# EAGLE design CommPosition_V1.0_Mar2016 (EAGLE 7.5.0)
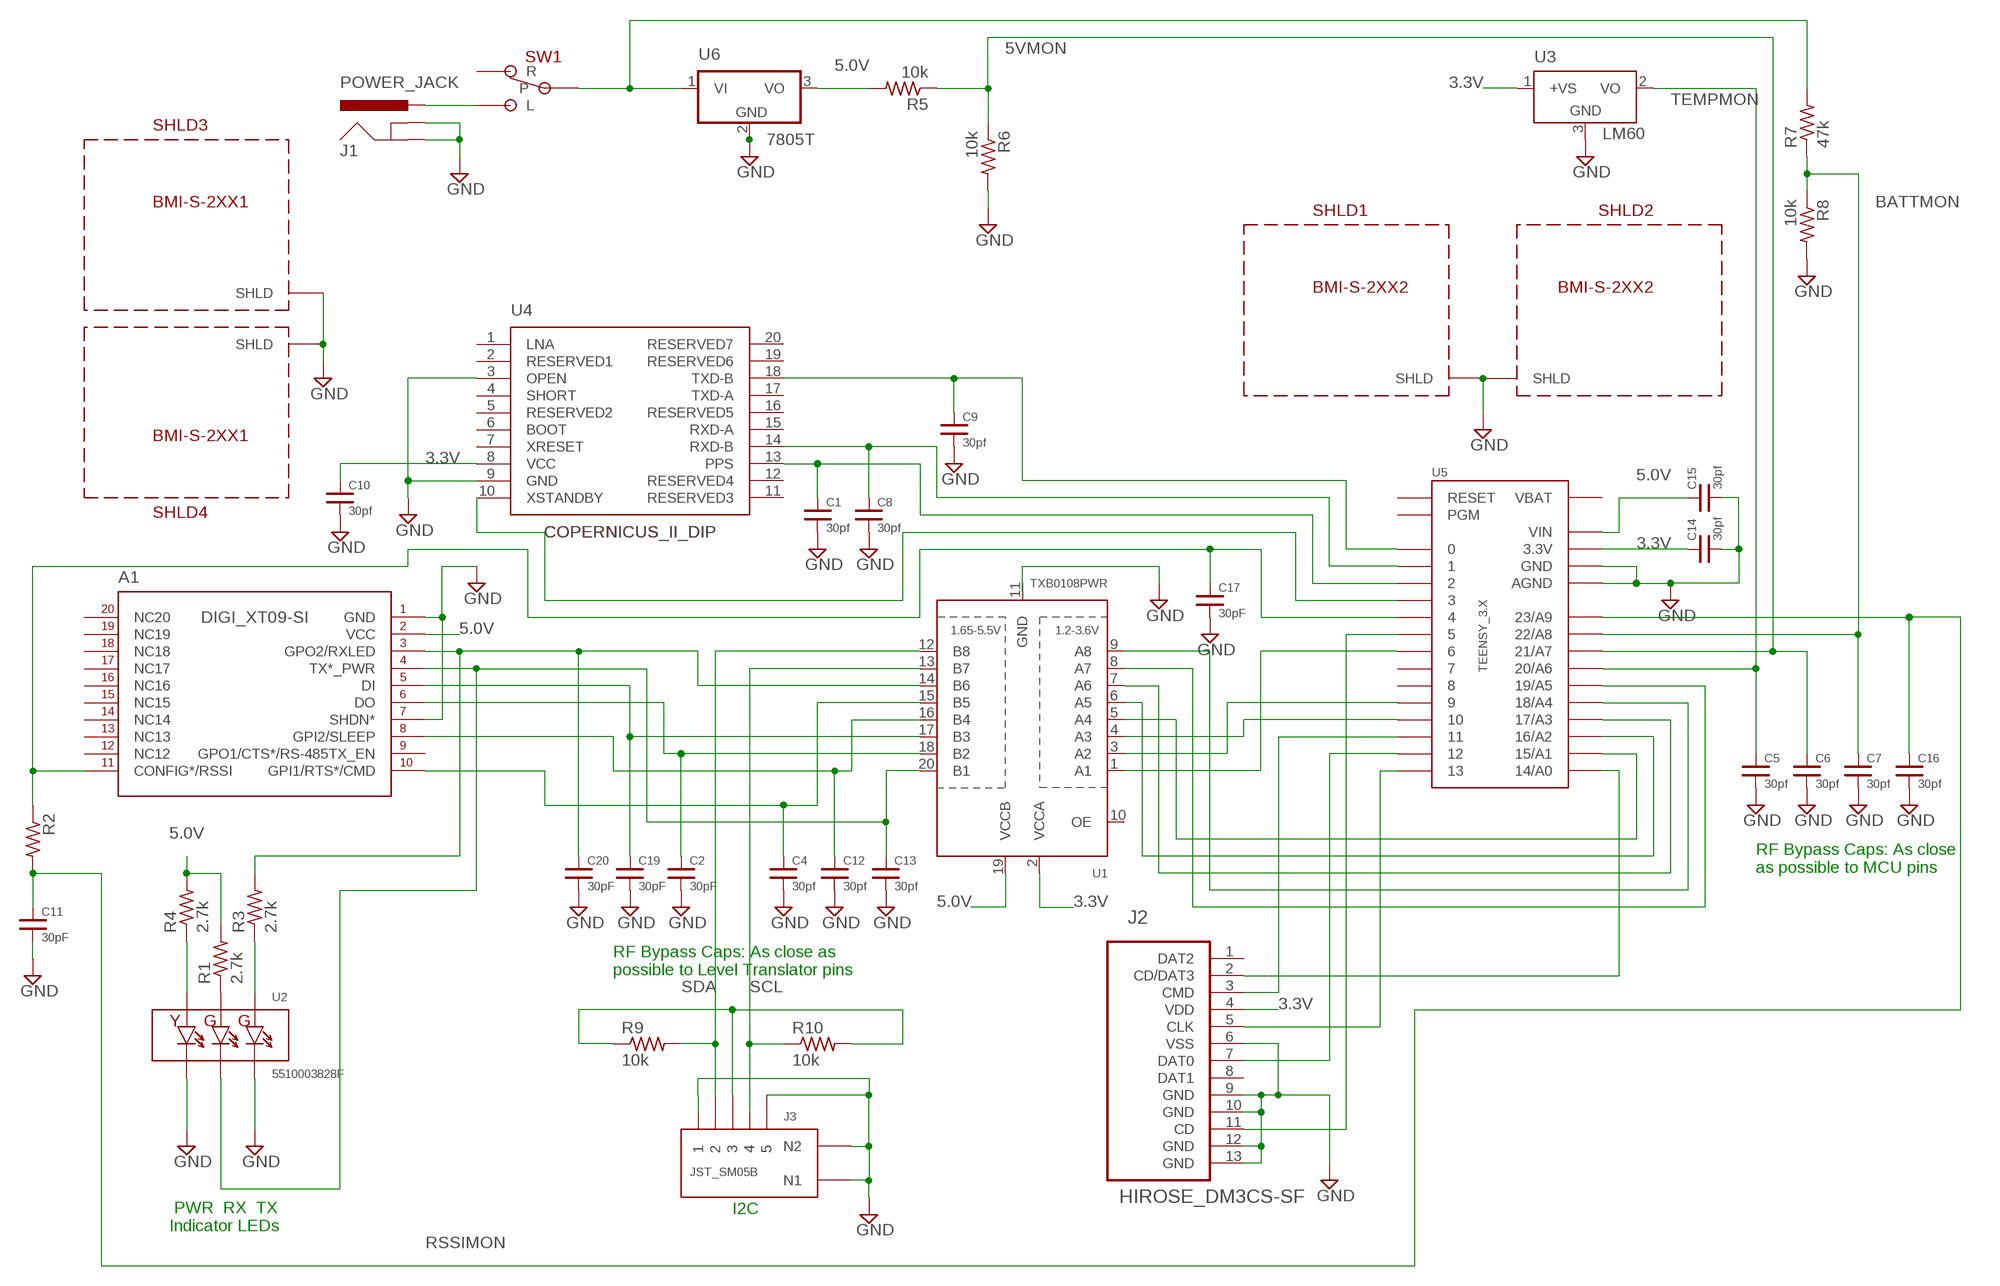
[diagram p0: schematic, sheet 1]

## Parts
A1  DIGI_XT09-SI  [DIGI_XT09-SI]
C1  30pf  C-USC0603  [C0603]
C2  30pF  C-USC0603  [C0603]
C4  30pf  C-USC0603  [C0603]
C5  30pf  C-USC0603  [C0603]
C6  30pf  C-USC0603  [C0603]
C7  30pf  C-USC0603  [C0603]
C8  30pf  C-USC0603  [C0603]
C9  30pf  C-USC0603  [C0603]
C10  30pf  C-USC0603  [C0603]
C11  30pF  C-USC0603  [C0603]
C12  30pf  C-USC0603  [C0603]
C13  30pf  C-USC0603  [C0603]
C14  30pf  C-USC0603  [C0603]
C15  30pf  C-USC0603  [C0603]
C16  30pf  C-USC0603  [C0603]
C17  30pF  C-USC0603  [C0603]
C19  30pF  C-USC0603  [C0603]
C20  30pF  C-USC0603  [C0603]
J1  POWER_JACK  [PWR_JACK_BB]
J2  HIROSE_DM3CS-SF  [HIROSE_DM3CS-SF]
J3  JST_SM05B  [JST_SM05B]
R1  2.7k  R-US_R0805  [R0805]
R2  R-US_R0805  [R0805]
R3  2.7k  R-US_R0805  [R0805]
R4  2.7k  R-US_R0805  [R0805]
R5  10k  R-US_R0805  [R0805]
R6  10k  R-US_R0805  [R0805]
R7  47k  R-US_R0805  [R0805]
R8  10k  R-US_R0805  [R0805]
R9  10k  R-US_R0805  [R0805]
R10  10k  R-US_R0805  [R0805]
SHLD1  BMI-S-2XX2  [BMI-S-207-F]
SHLD2  BMI-S-2XX2  [BMI-S-207-F]
SHLD3  BMI-S-2XX1  [BMI-S-206-F]
SHLD4  BMI-S-2XX1  [BMI-S-206-F]
SW1  SPDT_RA_3A  [ESWITCH_SPDT_RA]
U1  TXB0108PWR  [TSSOP20]
U2  5510003828F  [TRIPLE_LED_SIDE_0.1IN]
U3  LM60  [TO92]
U4  COPERNICUS_II_DIP  [COPERNICUS_II_DIP]
U5  TEENSY_3.X  [TEENSY_3.X_PERIPHERY]
U6  7805T  [TO220H]

## Nets
3.3V: C10.1 C14.1 J2.4(VDD) U1.2(VCCA) U3.1(+VS) U4.8(VCC) U5.3.3V U5.3.3V1(3.3V)
5.0V: A1.P$2(VCC) C15.1 R1.2 R4.2 R5.2 U1.19(VCCB) U5.VIN U6.3(VO)
5VMON: C6.1 R5.1 R6.1 U5.21/A7
BATTMON: C7.1 R7.1 R8.1 U5.22/A8
GND: A1.P$1(GND) A1.P$7(SHDN*) A1.P$21(GND) A1.P$22(GND) A1.P$23(GND) A1.P$24(GND) C1.2 C2.2 C4.2 C5.2 C6.2 C7.2 C8.2 C9.2 C10.2 C11.2 C12.2 C13.2 C14.2 C15.2 C16.2 C17.2 C19.2 C20.2 J1.GND J1.GNDBREAK J2.6(VSS) J2.9(GND) J2.10(GND) J2.12(GND) J2.13(GND) J3.P$1 J3.P$5 J3.P$6(N1) J3.P$7(N2) R6.2 R8.2 SHLD1.P$2(SHLD) SHLD1.P$3(SHLD) SHLD1.P$4(SHLD) SHLD1.P$5(SHLD) SHLD1.P$6(SHLD) SHLD1.P$7(SHLD) SHLD1.P$8(SHLD) SHLD1.P$9(SHLD) SHLD1.P$10(SHLD) SHLD1.P$11(SHLD) SHLD1.P$12(SHLD) SHLD1.P$14(SHLD) SHLD1.P$15(SHLD) SHLD1.P$16(SHLD) SHLD1.P$17(SHLD) SHLD1.P$18(SHLD) SHLD1.P$19(SHLD) SHLD1.P$20(SHLD) SHLD1.P$21(SHLD) SHLD1.P$22(SHLD) SHLD1.P$23(SHLD) SHLD1.P$24(SHLD) SHLD1.P$25(SHLD) SHLD1.P$26(SHLD) SHLD1.P$27(SHLD) SHLD1.P$28(SHLD) SHLD1.P$29(SHLD) SHLD1.P$30(SHLD) SHLD1.P$31(SHLD) SHLD1.P$32(SHLD) SHLD1.P$33(SHLD) SHLD1.P$34(SHLD) SHLD2.P$2(SHLD) SHLD2.P$3(SHLD) SHLD2.P$4(SHLD) SHLD2.P$5(SHLD) SHLD2.P$6(SHLD) SHLD2.P$7(SHLD) SHLD2.P$8(SHLD) SHLD2.P$9(SHLD) SHLD2.P$10(SHLD) SHLD2.P$11(SHLD) SHLD2.P$12(SHLD) SHLD2.P$14(SHLD) SHLD2.P$15(SHLD) SHLD2.P$16(SHLD) SHLD2.P$17(SHLD) SHLD2.P$18(SHLD) SHLD2.P$19(SHLD) SHLD2.P$20(SHLD) SHLD2.P$21(SHLD) SHLD2.P$22(SHLD) SHLD2.P$23(SHLD) SHLD2.P$24(SHLD) SHLD2.P$25(SHLD) SHLD2.P$26(SHLD) SHLD2.P$27(SHLD) SHLD2.P$28(SHLD) SHLD2.P$29(SHLD) SHLD2.P$30(SHLD) SHLD2.P$31(SHLD) SHLD2.P$32(SHLD) SHLD2.P$33(SHLD) SHLD2.P$34(SHLD) SHLD3.P$1(SHLD) SHLD3.P$2(SHLD) SHLD3.P$3(SHLD) SHLD3.P$4(SHLD) SHLD3.P$5(SHLD) SHLD3.P$6(SHLD) SHLD3.P$7(SHLD) SHLD3.P$8(SHLD) SHLD3.P$9(SHLD) SHLD3.P$10(SHLD) SHLD3.P$11(SHLD) SHLD3.P$12(SHLD) SHLD3.P$14(SHLD) SHLD3.P$15(SHLD) SHLD3.P$16(SHLD) SHLD3.P$17(SHLD) SHLD3.P$18(SHLD) SHLD3.P$21(SHLD) SHLD3.P$22(SHLD) SHLD3.P$23(SHLD) SHLD3.P$24(SHLD) SHLD3.P$25(SHLD) SHLD3.P$31(SHLD) SHLD3.P$32(SHLD) SHLD4.P$1(SHLD) SHLD4.P$2(SHLD) SHLD4.P$3(SHLD) SHLD4.P$4(SHLD) SHLD4.P$5(SHLD) SHLD4.P$6(SHLD) SHLD4.P$7(SHLD) SHLD4.P$8(SHLD) SHLD4.P$9(SHLD) SHLD4.P$10(SHLD) SHLD4.P$11(SHLD) SHLD4.P$12(SHLD) SHLD4.P$14(SHLD) SHLD4.P$15(SHLD) SHLD4.P$16(SHLD) SHLD4.P$17(SHLD) SHLD4.P$18(SHLD) SHLD4.P$21(SHLD) SHLD4.P$22(SHLD) SHLD4.P$23(SHLD) SHLD4.P$24(SHLD) SHLD4.P$25(SHLD) SHLD4.P$31(SHLD) SHLD4.P$32(SHLD) U1.11(GND) U2.P$1 U2.P$5 U3.3(GND) U4.3(OPEN) U4.9(GND) U5.AGND U5.GND U5.GND1(GND) U6.2(GND)
N$1: J2.7(DAT0) U5.12
N$2: J2.3(CMD) U5.11
N$3: J2.5(CLK) U5.13
N$4: U1.3(A2) U5.9
N$5: A1.P$5(DI) C19.1 U1.17(B3)
N$6: U1.9(A8) U5.18/A4
N$7: J2.2(CD/DAT3) U5.14/A0
N$8: A1.P$6(DO) C2.1 U1.18(B2)
N$9: U1.8(A7) U5.19/A5
N$11: A1.P$10(GPI1/RTS*/CMD) C4.1 U1.15(B5)
N$12: A1.P$4(TX*_PWR) C13.1 U1.20(B1) U2.P$3
N$13: A1.P$8(GPI2/SLEEP) C12.1 U1.16(B4)
N$14: A1.P$3(GPO2/RXLED) C20.1 R3.2 U1.14(B6)
N$15: U1.1(A1) U5.6
N$16: A1.P$11(CONFIG*/RSSI) C17.1 R2.1 U5.4
N$17: R7.2 SW1.P$2(P) U6.1(VI)
N$18: J1.PWR SW1.P$1(L)
N$19: J2.11(CD) U5.5
N$21: U4.10(XSTANDBY) U5.3
N$22: J3.P$3 R9.1 R10.2
N$23: U1.5(A4) U5.15/A1
N$24: U1.6(A5) U5.16/A2
N$25: U1.4(A3) U5.10
N$26: U1.7(A6) U5.17/A3
N$28: C9.1 U4.18(TXD-B) U5.0
N$29: C8.1 U4.14(RXD-B) U5.1
N$30: C1.1 U4.13(PPS) U5.2
N$34: R1.1 U2.P$4
N$35: R3.1 U2.P$2
N$36: R4.1 U2.P$6
RSSIMON: C11.1 C16.1 R2.2 U5.23/A9
SCL: J3.P$4 R10.1 U1.13(B7)
SDA: J3.P$2 R9.2 U1.12(B8)
TEMPMON: C5.1 U3.2(VO) U5.20/A6
Unconnected: A1.P$9(GPO1/CTS*/RS-485TX_EN) A1.P$12(NC12) A1.P$13(NC13) A1.P$14(NC14) A1.P$15(NC15) A1.P$16(NC16) A1.P$17(NC17) A1.P$18(NC18) A1.P$19(NC19) A1.P$20(NC20) J2.1(DAT2) J2.8(DAT1) SW1.P$3(R) U1.10(OE) U4.1(LNA) U4.2(RESERVED1) U4.4(SHORT) U4.5(RESERVED2) U4.6(BOOT) U4.7(XRESET) U4.11(RESERVED3) U4.12(RESERVED4) U4.15(RXD-A) U4.16(RESERVED5) U4.17(TXD-A) U4.19(RESERVED6) U4.20(RESERVED7) U5.7 U5.8 U5.PGM U5.RESET/A14/DAC(RESET) U5.VBAT

## Notes on the sheet
- RF Bypass Caps: As close
  as possible to MCU pins
- RF Bypass Caps: As close as
  possible to Level Translator pins
- I2C
- PWR  RX  TX
  Indicator LEDs

## Library data of the parts
A1 = fhdevices:DIGI_XT09-SI
C1 C2 C4-C17 C19 C20 = adafruit-fh:C-US: CAPACITOR, American symbol
J1 = fhmechanical:POWER_JACK: Power Jack This is the standard 5.5mm barrel jack for power. The PTH is the most common, proven, reliable, footprint. The Slot footprint only works if the mill layer is transmitted to the PCB fab house so be warned. Mating wall wart : TOL-00298 (and others)
J2 = borkedlabs-connectors:HIROSE_DM3CS-SF: DM3CS, Hinge, Push -Pull (no ejection mechanism), Top board mounting (Standard); MPN: DM3CS-SF; OC_FARNELL: 1764376; OC_NEWARK: 35R0581; PACKAGE: SMD - microSD; SUPPLIER: HIROSE
J3 = fhmechanical:JST_SM05B
R1-R10 = adafruit-fh:R-US_: RESISTOR, American symbol
SHLD1-SHLD4 = fhmechanical:BMI-S-2XX
SW1 = fhmechanical:SPDT_RA_3A
U1 = adafruit-fh:TXB0108PWR: 8-Bit Bi-Directional Level Shifter 1.2V-3.6V (VCCA) to 1.65V-5.5V (VCCB) bi-directional level shifter with auto direction sensing. Max data rate - VCCA 1.8V: 20Mbps (50ns), VCCA 3.3V: 100Mbps (10ns) Digikey: 296-21527-1-ND
U2 = fhdevices:5510003828F
U3 = fhdevices:LM60
U4 = fhdevices:COPERNICUS_II_DIP
U5 = fhdevices:TEENSY_3.X: Basic Teensy 3.0 with none of the 'inner' pins enabled. See '+4', 'AllAnalogPins", and 'AllPins' packages for additional pin holes, as needed.
U6 = fhpower:78*: Positive VOLTAGE REGULATOR Source: http://cache.national.com/ds/LM/LM78L05.pdf http://www.fairchildsemi.com/ds/LM/LM7805.pdf

## Board
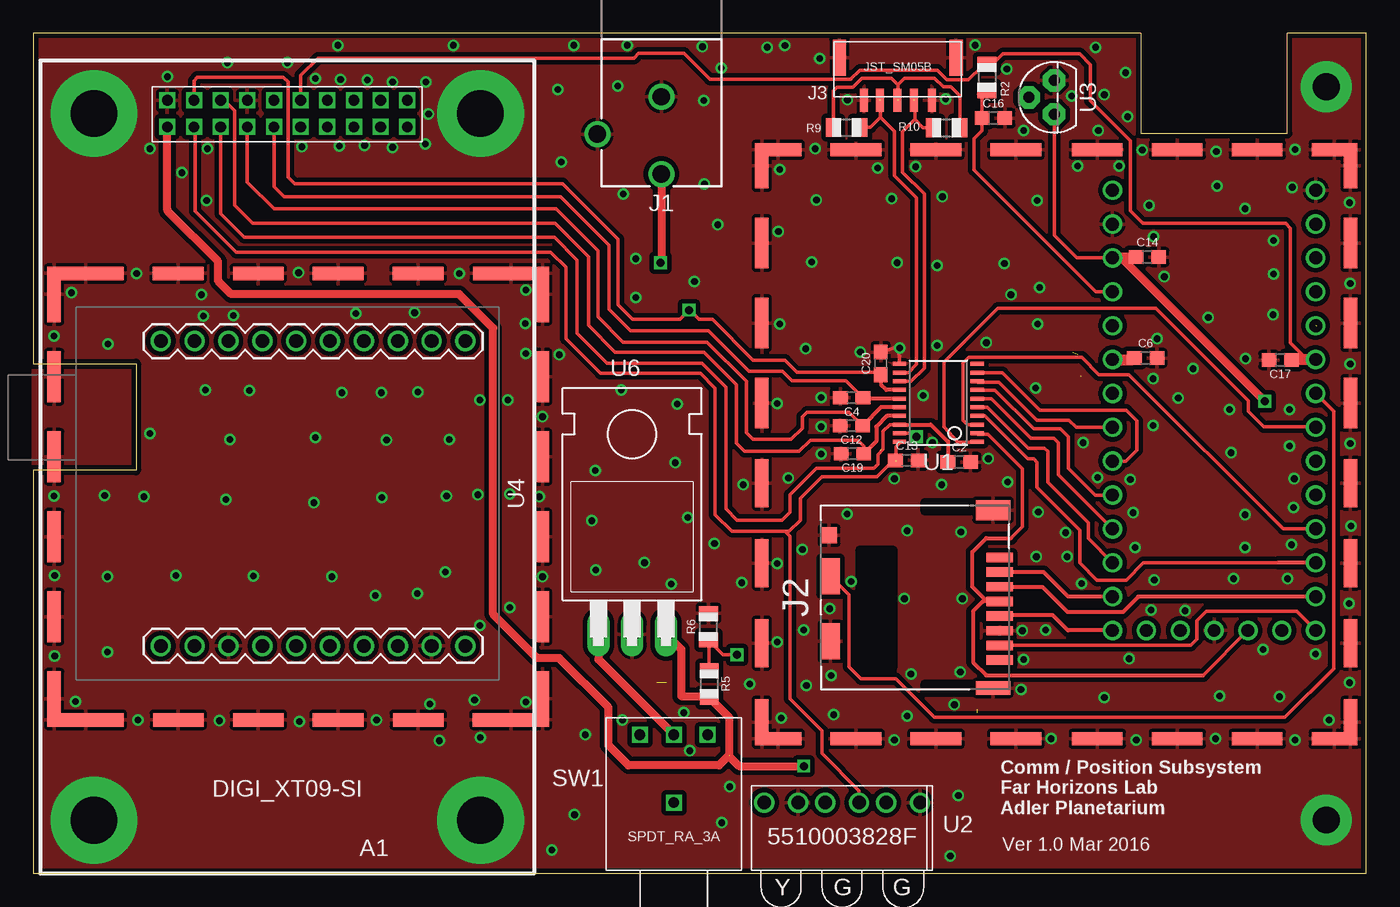
[diagram p1: board, top side]
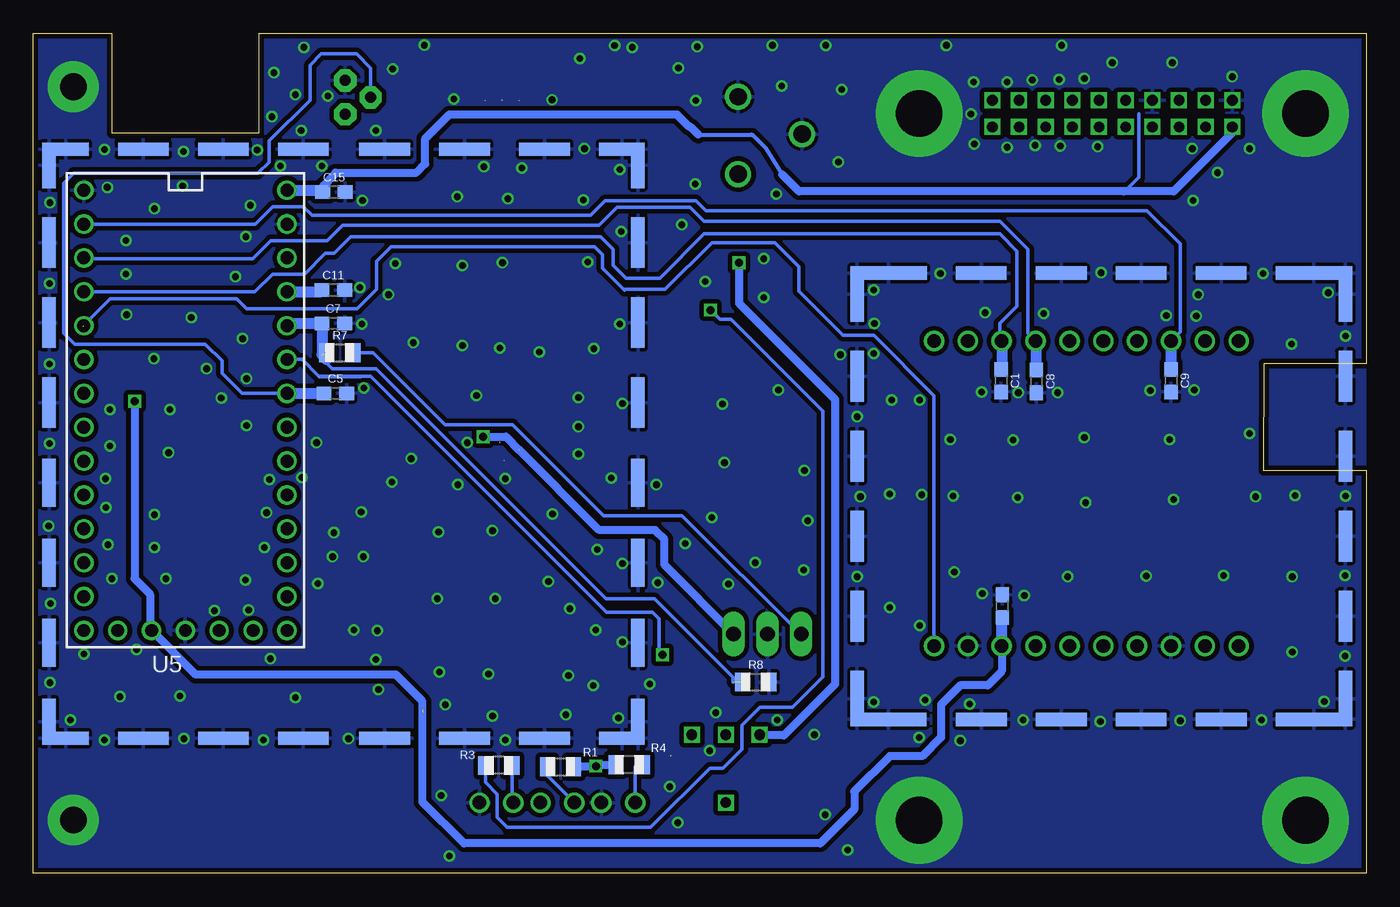
[diagram p2: board, bottom side, seen from below]

Size 100 x 63 mm. Coordinates in mm from the lower left corner, seen from the top.
Outline: 0,0 100,0 100,63 94.09,63 94.09,55.5 83.09,55.5 83.09,63 0,63 0,38.23 7.7,38.23 7.71,30.23 0,30.23 0,0
Copper layers (1*16): Top 0.0356mm / dielectric 1.5011mm / Bottom 0.0356mm
Design rules "LaenPCBOrder *": minimum track width 6mil, minimum drill 13mil, track to track 6mil, track to pad 6mil, pad to pad 6mil, via to via 6mil, smd to smd 6mil, copper to edge 15mil, drill to drill 6mil, minimum pad ring 7mil, minimum via ring 7mil, stop-mask expansion 4mil, vias tented up to drill 0mil, thermal gap 10mil

### Footprints (pad centres in the part's own frame; a part is rotated, then mirrored left to right if it is on the bottom)
DIGI_XT09-SI = drill 0.8 square: P$1 27.5,9; P$2 25.5,9; P$3 27.5,7; P$4 25.5,7; P$5 27.5,5; P$6 25.5,5; P$7 27.5,3; P$8 25.5,3; P$9 27.5,1; P$10 25.5,1; P$11 27.5,-1; P$12 25.5,-1; P$13 27.5,-3; P$14 25.5,-3; P$15 27.5,-5; P$16 25.5,-5; P$17 27.5,-7; P$18 25.5,-7; P$19 27.5,-9; P$20 25.5,-9 | drill 3.5 pad 6.5: P$21 26.5,14.5; P$22 26.5,-14.5; P$23 -26.5,14.5; P$24 -26.5,-14.5
C0603 = smd 1.1 x 1: 1 -0.85,0; 2 0.85,0
PWR_JACK_BB = drill 1.3: GND 0,7.9; GNDBREAK 4.8,10.7; PWR 0,13.7
HIROSE_DM3CS-SF = smd 0.7 x 2: 1 0,0; 2 -1.1,0; 3 -2.2,0; 4 -3.3,0; 5 -4.4,0; 6 -5.5,0; 7 -6.6,0; 8 -7.7,0 | smd 1.5 x 2.6: 9 3.55,0.5 | smd 1.2 x 1.2: 10 1.65,12.8 | smd 2.7 x 1.4: 11 -1.4,12.7; 12 -6.3,12.7 | smd 1 x 2.6: 13 -9.8,0.5
JST_SM05B = smd 0.6 x 1.7: P$1 2.51,2.485; P$2 1.31,2.485; P$3 0.01,2.485; P$4 -1.24,2.485; P$5 -2.57,2.485 | smd 1 x 2.7: P$6 4.36,-0.715; P$7 -4.385,-0.715
R0805 = smd 1.1 x 1.4: 1 -1,0; 2 1,0
BMI-S-207-F = smd 3.4 x 1: P$2 43.47,44.67; P$5 43.47,0.5 | smd 3.8 x 1: P$3 7.57,44.67; P$14 13.57,0.5; P$15 19.57,0.5; P$16 25.67,0.5; P$17 31.67,0.5; P$18 7.57,0.5; P$27 13.57,44.67; P$28 19.57,44.67; P$29 25.67,44.67; P$30 31.67,44.67; P$33 37.67,0.5; P$34 37.67,44.67 | smd 1 x 3.47: P$4 44.67,1.735; P$31 0.5,1.735 | smd 1 x 3.6: P$6 44.67,7.67; P$7 44.67,13.67; P$8 44.67,19.67; P$23 0.5,19.67; P$24 0.5,13.67; P$25 0.5,7.67 | smd 1 x 3.8: P$9 44.67,25.67; P$10 44.67,31.67; P$11 44.67,37.67; P$20 0.5,37.67; P$21 0.5,31.67; P$22 0.5,25.67 | smd 1 x 3.4: P$12 44.67,43.47; P$19 0.5,43.47 | smd 3.47 x 1: P$26 1.735,44.67; P$32 1.735,0.5
BMI-S-206-F = smd 3.8 x 1: P$1 26.24,37.13; P$9 20.24,37.13; P$10 14.24,37.13; P$11 8.24,37.13; P$14 14.24,0.5; P$15 20.24,0.5; P$16 26.24,0.5; P$18 8.24,0.5 | smd 1 x 5.71: P$2 33.98,2.855; P$21 0.5,34.775 | smd 1 x 3.8: P$3 33.98,9.82; P$4 33.98,15.82; P$5 33.98,21.81; P$6 33.98,27.82; P$22 0.5,27.81; P$23 0.5,21.81; P$24 0.5,15.82; P$25 0.5,9.81 | smd 1 x 5.72: P$7 33.98,34.77; P$31 0.5,2.86 | smd 4.14 x 1: P$8 32.41,37.13; P$12 2.07,37.13; P$17 32.41,0.5; P$32 2.07,0.5
ESWITCH_SPDT_RA = drill 0.8 square: P$1 2.54,-2.54; P$2 0,-2.54; P$3 -2.54,-2.54; P$4 0,2.54
TSSOP20 = smd 0.305 x 0.991: 1 -2.925,-2.918; 2 -2.275,-2.918; 3 -1.625,-2.918; 4 -0.975,-2.918; 5 -0.325,-2.918; 6 0.325,-2.918; 7 0.975,-2.918; 8 1.625,-2.918; 9 2.275,-2.918; 10 2.925,-2.918; 11 2.925,2.918; 12 2.275,2.918; 13 1.625,2.918; 14 0.975,2.918; 15 0.325,2.918; 16 -0.325,2.918; 17 -0.975,2.918; 18 -1.625,2.918; 19 -2.275,2.918; 20 -2.925,2.918
TRIPLE_LED_SIDE_0.1IN = drill 1.016: P$1 5.842,0; P$2 3.302,0; P$3 1.27,0; P$4 -1.27,0; P$5 -3.302,0; P$6 -5.842,0
TO92 = drill 0.813 pad 1.676 octagon: 1 -1.27,0; 2 0,1.905; 3 1.27,0
COPERNICUS_II_DIP = drill 1.016: 1 0,0; 2 2.54,0; 3 5.08,0; 4 7.62,0; 5 10.16,0; 6 12.7,0; 7 15.24,0; 8 17.78,0; 9 20.32,0; 10 22.86,0; 11 22.86,22.86; 12 20.32,22.86; 13 17.78,22.86; 14 15.24,22.86; 15 12.7,22.86; 16 10.16,22.86; 17 7.62,22.86; 18 5.08,22.86; 19 2.54,22.86; 20 0,22.86
TEENSY_3.X_PERIPHERY = drill 0.965: 0 -7.62,13.97; 1 -7.62,11.43; 2 -7.62,8.89; 3 -7.62,6.35; 3.3V 7.62,11.43; 3.3V1 -2.54,-16.51; 4 -7.62,3.81; 5 -7.62,1.27; 6 -7.62,-1.27; 7 -7.62,-3.81; 8 -7.62,-6.35; 9 -7.62,-8.89; 10 -7.62,-11.43; 11 -7.62,-13.97; 12 -7.62,-16.51; 13 7.62,-16.51; 14/A0 7.62,-13.97; 15/A1 7.62,-11.43; 16/A2 7.62,-8.89; 17/A3 7.62,-6.35; 18/A4 7.62,-3.81; 19/A5 7.62,-1.27; 20/A6 7.62,1.27; 21/A7 7.62,3.81; 22/A8 7.62,6.35; 23/A9 7.62,8.89; AGND 7.62,13.97; GND -7.62,16.51; GND1 0,-16.51; PGM 2.54,-16.51; RESET/A14/DAC 5.08,-16.51; VBAT -5.08,-16.51; VIN 7.62,16.51
TO220H = drill 1.118 long: 1 -2.54,-10.16; 2 0,-10.16; 3 2.54,-10.16

### Placement (x,y rotation side)
A1  19.05,30.48 90 top
C1  27.4,36.95 270 bottom
C2  69.47,30.85 0 top
C4  61.4,35.67 180 top
C5  77.35,36 0 bottom
C6  83.45,38.65 0 top
C7  77.5,41.25 0 bottom
C8  24.75,36.9 270 bottom
C9  14.65,36.95 270 bottom
C10  27.3,20.05 90 bottom
C11  77.5,43.75 0 bottom
C12  61.38,33.58 180 top
C13  65.53,30.98 0 top
C14  83.58,46.23 0 top
C15  77.45,51.1 0 bottom
C16  72.03,56.64 0 top
C17  93.55,38.5 180 top
C19  61.45,31.48 180 top
C20  63.58,38.25 90 top
J1  47.12,66.14 180 top
J2  72.5,23.7 90 top
J3  64.84,60.47 180 top
R1  60.45,8 0 bottom
R2  71.54,59.69 270 top
R3  65.08,8.1 180 bottom
R4  55.3,8.15 180 bottom
R5  50.7,14.2 270 top
R6  50.65,18.5 90 top
R7  77,39.05 0 bottom
R8  45.8,14.35 0 bottom
R9  61.02,55.94 0 top
R10  68.52,55.92 0 top
SHLD1  54.15,9.6 0 top
SHLD2  99.32,9.63 0 bottom
SHLD3  38.69,11.01 90 top
SHLD4  38.69,45.52 270 bottom
SW1  48.05,7.85 180 top
U1  67.9,35.28 90 top
U2  60.68,5.3 0 top
U3  76.6,58.2 90 top
U4  9.56,17.06 0 top
U5  88.59,34.73 0 bottom
U6  44.93,28.11 0 top

### Tracks (layer width: path | path; a pad name or v marks a point on that pad's centre or on a via)
3.3V  (via drill 0.6)  (1 unrouted)
  Top 0.254: 87.77,14.85 U5.3.3V1 | U1.2 70.88,32.95 71.6,32.95 74.2,30.35 74.2,26 73.35,25.15 | U5.3.3V 78.3,46.16 76.6,47.85 U3.1
  Top 0.305: 87.77,14.85 71.5,14.85 70.5,15.85 70.5,19.65 71.25,20.4 J2.4 71.55,20.4 70.45,21.5 70.45,24.1 71.5,25.15 73.35,25.15
  Top 0.61: 82.72,46.16 C14.1 | U5.3.3V 81.64,46.16 v92.4,35.4
  Top 0.813: U5.3.3V 82.66,46.16 C14.1
  Bottom 0.61: U4.8 27.34,15.16 28.4,14.1 30.45,14.1 31.9,12.65 31.9,10.2 33.3,8.8 35.75,8.8 38.4,6.15 38.4,4.8 40.95,2.25 67.7,2.25 70.8,5.35 70.8,12.3 | 70.8,12.05 70.8,12.9 72.8,14.9 87.81,14.9 U5.3.3V1 91.25,18.34 91.25,20.9 91.3,21 92.4,22.1 v92.4,35.4
  Bottom 0.813: U4.8 27.34,19.16 C10.1
5.0V  (via drill 0.6)  (2 unrouted)
  Top 0.254: U1.19 65.99,33.01 v66.25,32.75
  Top 0.61: A1.P$2 10.05,49.8 arc45 10.12,49.63 13.85,45.9 13.85,44.55 arc45 13.92,44.38 14.85,43.45 31.95,43.45 34.5,40.9 34.5,19.45 37.73,16.22 arc45 37.91,16.15 39.45,16.15 43.15,12.45 43.15,9.6 44.65,8.1 51.45,8.1 52.2,8.85 | U6.3 48.6,16.82 48.6,13.3 50.6,13.3 R5.2 52.2,11.7 52.2,8.8 52.95,8.05 v57.8,8.05
  Bottom 0.254: 17.05,56.98 17.05,52.2 18.1,51.15 18.2,51.15
  Bottom 0.305: 50.1,55.4 46.16,55.4 arc45 45.98,55.33 45.05,54.4 43.8,52.4
  Bottom 0.61: A1.P$2 10.05,55.55 14.45,51.15 18.2,51.15 42.55,51.15 43.8,52.4 | 50.1,55.4 50.63,55.93 arc-45 50.8,56 51.7,56.9 68.8,56.9 70.6,55.1 70.6,53.2 71.25,52.55 77.35,52.55 77.35,52.45 78.23,51.57 arc-45 78.3,51.4 C15.1 78.36,51.16 arc-45 78.54,51.23 | U6.3 52.58,23.06 arc45 52.65,23.23 52.65,25.05 53.35,25.75 57.55,25.75 63.6,31.8 | v66.25,32.75 64.55,32.75 63.55,31.75 | R1.2 57.85,8 v57.8,8.05 57.7,8.15 R4.2
  Bottom 0.813: U5.VIN 78.44,51.23 C15.1
5VMON  (via drill 0.6)  (1 unrouted)
  Top 0.254: R5.1 50.7,17.45 R6.1 51.75,16.4 v52.8,16.4
  Top 0.813: U5.21/A7 82.48,38.53 C6.1
  Bottom 0.254: v52.8,16.4 53.05,16.65 53.05,19.1 53.55,19.6 57,19.6 74.7,37.3 78.6,37.3 79.85,38.55 80.95,38.55 U5.21/A7 | 75.45,37.25 78.55,37.25
BATTMON  (2 unrouted)
  Bottom 0.254: 47.5,14.35 47.5,14.7 53.4,20.6 57.05,20.6 74.3,37.85 77.6,37.85 78,38.25 78,38.55
  Bottom 0.813: U5.22/A8 80.8,41.25 C7.1 78.35,38.9 78,38.55
GND  (via drill 0.5, 2 pad 3.81)
  Top 0.254: C20.2 64.95,39.55 U1.11
  other vias: 97,59 97,4 84.85,44.75 84.3,40.1 88.15,41.7 75.35,41.2 73.35,43.4 75.5,43.95 74.2,18.2 74.3,16.05 74.1,13.8 69.55,15.1 69.7,20.6 69.6,25.6 65.55,25.7 65.35,20.6 65.85,14.95 59.75,19.85 61.05,26.95 59.85,14.85 59.1,35.7 59.1,33.5 59.1,31.45 69.1,12.65 80.35,13.2 89,13.3 92.25,16.8 96.2,16.45 93.5,13.25 82.2,16.1 75.95,18.25 94.55,27.45 94.6,29.6 94.25,32.05 89.85,31.55 89.75,34.8 87,37.85 85.9,35.65 84,37.1 94.25,34.8 90.95,38.6 93,41.9 93.05,44.95 93.05,47.45 90.9,49.85 84.05,47.75 78.35,53.05 58.65,54.35 55.9,48.15 56,52.8 56,41.2 58.4,45.85 57.95,39.35 62.05,39.1 65,39.4 64.8,45.8 66.75,35.85 67.8,39.6 71.5,39.8 67.8,45.6 72.85,45.75 68.2,50.75 75.3,50.45 64.4,50.6 58.75,50.5 65.55,11.8 60.05,11.9 58,14.1 57.8,18.25 55.8,35.25 53.25,29.15 56.65,29.65 57.7,24.3 55.8,23.25 53.15,21.8 61.35,21.9 55.8,17.35 56.1,11.65 53.75,14.2 64.6,10 76.35,10.1 82.75,10 88.7,10.1 94.65,10 97.2,11.5 98.75,14.3 98.7,20.25 98.85,26.05 98.8,32.25 98.8,38.2 98.8,44.25 98.75,50.3 94.65,54.3 88.75,54.15 83.2,54.25 63.35,52.9 66.2,53 81.45,53.05 3.15,12.9 7.85,11.5 13.95,11.45 19.95,11.4 25.75,11.5 30.45,9.95 29.75,12.7 33.55,10.2 33.1,13 36.95,12.85 38.2,22.25 37.95,28.25 38.2,34.25 39.45,38.9 36.95,39 36.9,41.25 36.95,43.75 31.95,45 19.9,45.05 24.2,42 28.6,42.05 7.75,45 1.55,40.3 1.55,28.3 12.6,43.4 15,41.85 2.85,43.55 1.6,22.35 1.6,16.3 12.9,36.25 16.2,36.2 23.15,36.05 26.1,36.05 28.85,36.1 28.8,21 25.65,20.85 5.6,39.7 5.35,28.35 5.55,22.25 5.55,16.6 10.7,22.35 16.5,22.3 22.4,22.25 30.9,22.6 31,28.3 26.15,28.2 21.05,27.8 14.45,28.05 8.3,28.25 31.2,32.55 26.5,32.5 21.15,32.7 14.75,32.55 8.75,33 33.5,35.5 33.35,28.4 33.5,18.6 35.6,35.5 35.75,28.45 35.75,19.95 84,33.6 84.1,22 90.05,22.1 94.1,22.1 83.85,19.75 86.4,19.7 75.4,27.1 75.25,23.75 78.65,21.75 77.55,23.75 77.45,25.55 94.4,24.65 90.9,26.9 90.9,24.45 75.2,36.4 71.65,31.1 73.1,29.35 68.15,29.15 78.75,32.3 79.85,29.7 82.3,29.55 82.5,27.05 82.65,24.45 45.2,43.2 45.2,46.1 49.6,44.4 51.35,48.65 48.3,35.2 44.1,36.25 42.15,30.2 48.15,30.8 49.1,26.7 41.9,26.45 42.2,22.75 45.85,23.3 47.85,21.7 51.1,24.75 48.8,12.05 11.15,52.55 10.05,59.75 8.75,54.35 20.15,54.5 22.95,54.55 24.85,54.6 26.95,54.45 29.4,54.7 29.65,56.95 29.45,59.35 26.95,59.35 25.05,59.5 23.05,59.55 21.15,59.6 19.05,60.8 14.55,60.8 13,50.45 13.05,54.35 44.2,11.5 59,61.1 51.6,60.4 70.66,62.11 94.45,51.45 88.8,51.55 73.04,60.32 69.4,5.85 52.25,6.5 49.25,9.2 64.6,29.6 67.45,32.3 44.25,50.95 50.35,51.7 83.7,50.1 22.85,62.1 31.5,62.1 40.55,62.1 44.55,62.1 50.2,62 50.3,57.95 43.85,59.05 39.6,53.35 39.35,58.8 61.08,58.02 68.45,58.07 55.06,61.95 56.39,62.09 74.29,55.71 77.9,58.3 79.9,55.7 79.7,61.95 82.1,56.75 81.95,60.05 80.35,58.4 12.75,41.8 51.65,3.8 40.6,4.4 41.4,10.4 38.9,1.75 68.8,1.3
  pour Top (isolate 0.35): 0,63.1 100.05,63.1 100.05,-0.1 0,-0.1
  pour Bottom (isolate 0.35): 0.1,63 100.15,63 100.15,-0.1 0.1,-0.1
N$1
  Top 0.254: U5.12 94.78,19.65 88,19.65 87.3,18.95 87.3,17.55 86.85,17.1 J2.7
N$2
  Top 0.305: U5.11 82.91,20.75 81.75,19.6 77.6,19.6 75.75,21.45 72.55,21.45 J2.3
N$3
  Top 0.305: U5.13 77.64,18.21 76.5,19.35 72.55,19.35 J2.5
N$4
  Top 0.254: 70.76,33.6 U1.3 70.09,33.66 69.75,34 69.75,38.25 70.2,38.7 78.65,38.7 79.95,37.4 82.2,37.4 93.77,25.84 U5.9
N$5
  Top 0.254: C19.1 62.3,32.05 61.85,32.5 58.3,32.5 57.45,31.65 53.35,31.65 52.75,32.25 52.75,36.65 50.3,39.1 43.65,39.1 41.65,41.1 41.65,46.25 39.15,48.75 16.45,48.75 15.1,50.1 15.1,57.2 14.32,57.98 A1.P$5
  Top 0.305: U1.17 64.06,34.31 63.25,33.5 63.25,32.42 C19.1
N$6
  Top 0.254: U5.18/A4 81.97,30.91 82.8,31.75 82.8,33.95 82,34.75 75.5,34.75 72.7,37.55 U1.9
N$7
  Top 0.305: U5.14/A0 77.64,20.75 75.8,22.6 J2.2
N$8
  Top 0.254: 68.65,30.88 C2.1 | U1.18 64.26,33.66 63.75,33.15 63.75,31.8 63.35,31.4 63.35,30.7 63.05,30.4 58.75,30.4 56.75,28.4 56.75,27.1 56.15,26.5 52.8,26.5 51.95,27.35 51.95,36.45 50.15,38.25 43.05,38.25 40.8,40.5 40.8,46 39.1,47.7 15.8,47.7 14.05,49.45 A1.P$6
  Top 0.305: U1.18 67.34,33.66 68.62,32.38 C2.1
N$9
  Top 0.254: U5.19/A5 78.25,33.45 77.7,34 75.3,34 72.45,36.85 70.88,36.85 U1.8
N$11
  Top 0.254: 62.25,35.61 C4.1 60.98,36.95 56.9,36.95 56.2,37.65 53.7,37.65 50.65,40.7 44.8,40.7 43.2,42.3 43.2,47.1 39.55,50.75 18.8,50.75 18.05,51.5 A1.P$10
  Top 0.305: U1.15 62.31,35.61 C4.1
N$12  (2 unrouted)
  Top 0.254: 65,32.3 64.7,32 64.7,30.95 64.5,30.95 63.3,29.75 59.15,29.75 57.55,28.15 57.55,26.5 56.7,25.65 56.4,25.65 | 56.4,25.65 52.4,25.65 51.15,26.9 51.15,36.4 50.05,37.5 42.55,37.5 39.95,40.1 39.95,45.45 38.8,46.6 15.2,46.6 12.15,49.65 12.15,55.88 A1.P$4 | U2.P$3 61.95,6.2 59.15,9 59.15,10.7 56.75,13.1 56.75,25.3 56.4,25.65
N$13
  Top 0.254: C12.1 61.2,34.6 58.05,34.6 57.7,34.25 57.7,33.4 56.85,32.55 54,32.55 53.5,33.05 53.5,36.9 50.55,39.85 44.25,39.85 42.35,41.75 42.35,46.7 39.2,49.85 18.05,49.85 16.05,51.85 A1.P$8
  Top 0.305: U1.16 63.61,34.96 C12.1
N$14  (via drill 0.6)
  Top 0.254: A1.P$3 12.05,59.45 12.3,59.7 18.75,59.7 19.1,59.35 19.1,52.2 19.6,51.7 39.7,51.7 43.85,47.55 43.85,42.65 44.95,41.55 48.5,41.55 v49.2,42.25 49.25,42.25 49.95,41.55 50.95,41.55 54,38.5 56.4,38.5 57.3,37.6 63.38,37.6 C20.1 63.58,36.67 63.6,36.65
  Top 0.305: U1.14 63.99,36.26 63.6,36.65
  Bottom 0.254: R3.2 66.08,6.83 65.2,5.95 65.2,4.2 64.45,3.45 53.7,3.45 49.25,7.9 48.25,7.9 46.85,9.3 46.85,11.1 45.5,12.45 43.05,12.45 40.75,14.75 40.75,34.65 47.65,41.55 48.5,41.55 v49.2,42.25
N$15
  Top 0.254: U5.6 96.17,33.5 92.3,33.5 91.15,34.65 91.15,35.45 84.2,42.4 72.35,42.4 68.3,38.35 68.3,33.5 69.35,32.35 70.81,32.35 U1.1
N$16
  Top 0.254: A1.P$11 20.05,59.85 21.35,61.15 45.05,61.15 45.4,61.5 48.8,61.5 50.75,59.55 61.33,59.54 61.31,59.54 62.02,60.25 67.82,60.25 68.55,59.52 70.16,59.52 71.19,60.55 71.52,60.55 71.6,60.47 71.57,60.44 71.57,60.41 | U5.4 95.56,38.53 94.3,39.8 94.3,48.4 93.95,48.75 83.25,48.75 82.3,49.7 82.3,54.95 79.3,57.95 79.3,60.65 78.5,61.45 72.74,61.45 71.57,60.28 71.57,60.41 | 71.57,60.41 R2.1
  Top 0.813: U5.4 94.44,38.53 C17.1
N$17
  Top 0.61: U6.1 42.39,16.05 SW1.P$2
  Bottom 0.254: U6.1 51.32,26.83 57.23,26.83 64.05,33.65 69.1,33.65 74.5,39.05 R7.2
N$18  (via drill 0.6)
  Top 0.61: J1.PWR 47.12,45.87 v47.05,45.8
  Bottom 0.61: v47.05,45.8 47.05,42.75 39.85,35.55 39.85,14.2 43.7,10.35 45.47,10.35 SW1.P$1
N$19
  Top 0.254: U5.5 97.55,34.66 97.55,15.35 93.9,11.7 67.6,11.7 64.7,14.6 62.1,14.6 61.2,15.5 61.2,20.9 J2.11
N$21  (1 unrouted)
  Bottom 0.254: 96.3,41.05 94.25,43.1 84.75,43.1 84,42.35 75.7,42.35 74.25,43.8 74.25,45.9 73.15,47 57.9,47 57.3,46.4 57.3,45.4 55.65,43.75 55.6,43.8 52.6,43.8 49.1,47.3 44.35,47.3 42.55,45.5 42.55,43.65 39.25,40.35 36.95,40.35 32.42,35.82 U4.10
N$22  (1 unrouted)
  Top 0.254: R9.1 60.02,58.68 60.29,58.95 61.49,58.95 62.17,59.63 64.38,59.63 64.86,59.15 | 64.86,59.15 64.86,58.02 | R10.2 69.52,58.32 68.86,58.98 68.29,58.98 67.62,59.65 65.36,59.65 64.86,59.15
N$23
  Top 0.254: U1.5 71.59,34.96 74.65,31.9 75.85,31.9 76.1,31.65 76.1,29.35 79.15,26.3 79.15,25.11 U5.15/A1
N$24
  Top 0.254: U1.6 71.89,35.61 74.85,32.65 76.55,32.65 76.9,32.3 76.9,29.91 U5.16/A2
N$25
  Top 0.254: 93.41,23.3 83.3,23.3 82,22 79.8,22 78.5,23.3 78.5,25.75 75.3,28.95 75.3,30.85 75.05,31.1 74.6,31.1 71.39,34.31 U1.4
  Top 0.305: U5.10 93.41,23.3
N$26
  Top 0.254: U5.17/A3 79.67,28.38 77.65,30.4 77.65,32.75 77.05,33.35 75.05,33.35 72.15,36.25 U1.7
N$28
  Bottom 0.254: U5.0 83.36,48.7 82.05,50 79.75,50 79.1,49.35 58.2,49.35 57.1,50.45 50.3,50.45 49.55,49.7 16.45,49.7 13.95,47.2 13.95,40.61 U4.18
  Bottom 0.813: U4.18 C9.1
N$29
  Bottom 0.254: U5.1 96.21,46.14 96.25,46.1 83.55,46.1 82.2,47.45 77.95,47.45 76.8,48.6 57.55,48.6 56.2,49.95 50.75,49.95 49.7,48.9 27.5,48.9 25.4,46.8 25.4,40.52 U4.14
  Bottom 0.813: U4.14 24.8,37.8 C8.1
N$30
  Bottom 0.254: U5.2 83.39,43.62 82.05,44.95 79.65,44.95 78.1,46.5 77.45,46.5 76.2,47.75 57.45,47.75 56.5,46.8 56.5,45.6 55.55,44.65 53,44.65 49.7,47.95 27.5,47.95 26.2,46.65 26.2,42.55 27.5,41.25 27.5,40.08 U4.13
  Bottom 0.813: U4.13 27.34,37.86 C1.1
N$34
  Bottom 0.254: U2.P$4 61.45,7.34 R1.1
N$35
  Bottom 0.254: U2.P$2 64.08,5.4 R3.1
N$36
  Bottom 0.254: U2.P$6 54.84,8.01 R4.1
RSSIMON
  Top 0.254: U5.23/A9 79.7,43.62 70.55,52.77 70.55,55.1 71.15,55.7 C16.1 71.15,58.18 R2.2 70.92,58.43
  Bottom 0.406: 78.35,43.62 C11.1
  Bottom 0.813: U5.23/A9 78.48,43.62 C11.1
SCL  (1 unrouted)
  Top 0.254: U1.13 65.86,36.91 66.85,37.9 66.85,50.95 65.2,52.6 65.2,55.61 66.13,56.54 | 66.13,56.54 66.13,57.96 66.09,57.99 66.07,58.02 | R10.1 66.75,55.92 66.13,56.54
SDA  (1 unrouted)
  Top 0.254: U1.12 65.64,37.56 66.25,38.17 66.25,50.66 64.6,52.31 64.6,55.66 63.56,56.7 | 63.56,56.7 63.56,57.97 | R9.2 62.8,55.94 63.56,56.7
TEMPMON
  Bottom 0.254: 78.5,35.7 C5.1 | U5.20/A6 84.34,35.99 85.85,37.5 85.85,38.45 87.1,39.7 96.9,39.7 97.7,40.5 97.7,51.75 96.95,52.5 83.15,52.5 82.3,53.35 82.3,54.95 79.25,58 79.25,60.6 78.4,61.45 75.75,61.45 74.69,60.4 U3.2
  Bottom 0.813: U5.20/A6 C5.1

### Text on the board
tPlace: Comm / Position Subsystem / Far Horizons Lab / Adler Planetarium | Ver 1.0 Mar 2016